# Altium project Fan and Temperature Daughter Board.PrjPcb
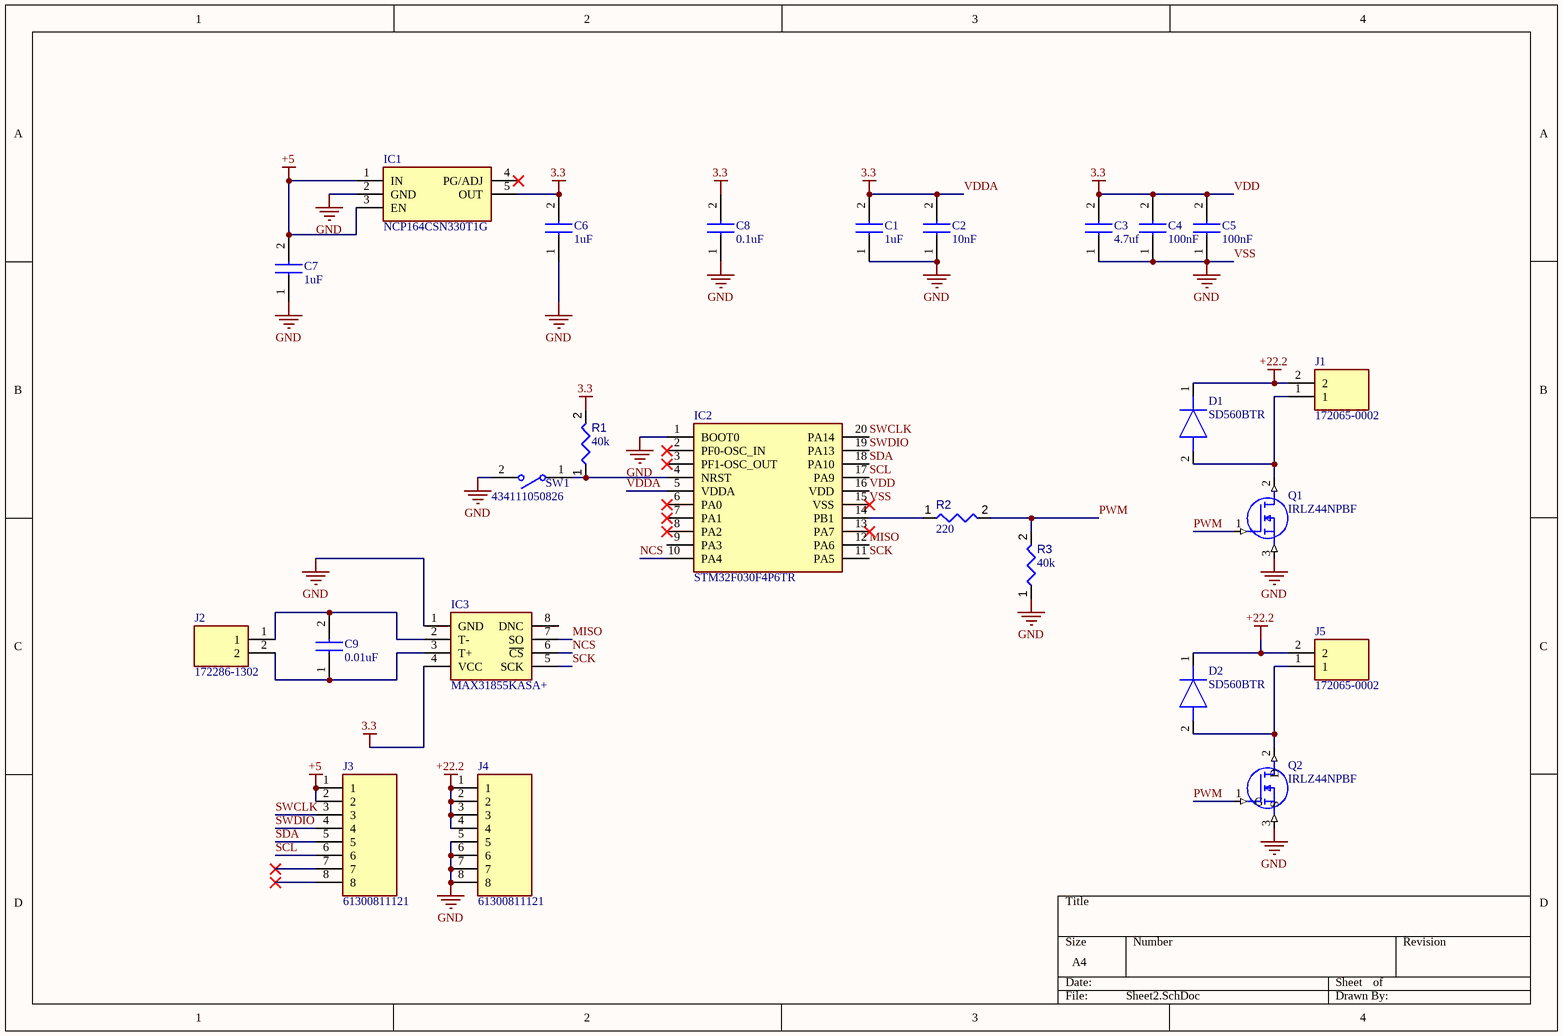
[diagram p0: Sheet2.SchDoc]
1 sheet, 25 parts. Net scope: global (net labels, ports and power ports of the same name join across sheets).
Board file: PCB2.PcbDoc

## Sheet Sheet2.SchDoc
size A4; SheetNumber: 1; SheetTotal: 1

### Parts
C1  1uF  [CAPC2012X94N]
C2  10nF  [CAPC2012X94N]
C3  4.7uf  [CAPC2012X94N]
C4  100nF  [CAPC2012X94N]
C5  100nF  [CAPC2012X94N]
C6  1uF  [CAPC2012X94N]
C7  1uF  [CAPC2012X94N]
C8  0.1uF  [CAPC2012X94N]
C9  0.01uF  [CAPC2012X94N]
D1  SD560BTR  [DIOM5236X260N]
D2  SD560BTR  [DIOM5236X260N]
IC1  NCP164CSN330T1G  [SOT95P275X110-5N]
IC2  STM32F030F4P6TR  [SOP65P640X120-20N]
IC3  MAX31855KASA+  [SOIC127P600X175-8N]
J1  172065-0002  [1720650002]
J2  172286-1302  [172286-YY02]
J3  61300811121  [HDRV8W64P0X254_1X8_2032X254X854P]
J4  61300811121  [HDRV8W64P0X254_1X8_2032X254X854P]
J5  172065-0002  [1720650002]
Q1  IRLZ44NPBF  [TO254P469X1042X1967-3P]
Q2  IRLZ44NPBF  [TO254P469X1042X1967-3P]
R1  value 40k  [RESC0805(2012)_L]  (hidden comment: Resistor 4R7  +/-5 % 0805 125 mW)
R2  value 220  [RESC0805(2012)_L]  (hidden comment: Resistor 4R7  +/-5 % 0805 125 mW)
R3  value 40k  [RESC0805(2012)_L]  (hidden comment: Resistor 4R7  +/-5 % 0805 125 mW)
SW1  434111050826  [434111050826]

### Nets
+5: C7.2 IC1.1(IN) IC1.3(EN) J3.1 J3.2
+22.2: D1.1(K) D2.1(K) J1.2 J4.1 J4.2 J4.3 J4.4 J5.2
VDD: C1.2 C2.2 C3.2 C4.2 C5.2 C6.2 C8.2 IC1.5(OUT) IC2.5(VDDA) IC2.16(VDD) IC3.4(VCC) R1.2  [also labelled 3.3, VDDA]
VSS: C1.1 C2.1 C3.1 C4.1 C5.1 C6.1 C7.1 C8.1 IC1.2(GND) IC2.1(BOOT0) IC2.15(VSS) IC3.1(GND) J4.5 J4.6 J4.7 J4.8 Q1.3(S) Q2.3(S) R3.1 SW1.2  [also labelled GND]
MISO: IC2.12(PA6) IC3.7(SO)
NCS: IC2.10(PA4) IC3.6(~{CS})
PWM: Q1.1(G) Q2.1(G) R2.2 R3.2
SCK: IC2.11(PA5) IC3.5(SCK)
SCL: IC2.17(PA9) J3.6
SDA: IC2.18(PA10) J3.5
SWCLK: IC2.20(PA14) J3.3
SWDIO: IC2.19(PA13) J3.4
NetC9_1: C9.1 IC3.3(T+) J2.2
NetC9_2: C9.2 IC3.2(T-) J2.1
NetD1_2: D1.2(A) J1.1 Q1.2(D)
NetD2_2: D2.2(A) J5.1 Q2.2(D)
NetIC2_4: IC2.4(NRST) R1.1 SW1.1
NetIC2_14: IC2.14(PB1) R2.1

Not connected (* = marked no-connect by the designer): IC1 4(PG/ADJ)*; IC2 2(PF0-OSC_IN)* 3(PF1-OSC_OUT)* 6(PA0)* 7(PA1)* 8(PA2)* 9(PA3) 13(PA7)*; IC3 8(DNC); J3 7* 8*

### Library data of the parts
C1-C9 = 08055C104K4T2A: Capacitor; Manufacturer_Name: Kyocera AVX; Datasheet Link: https://componentsearchengine.com/Datasheets/2/08055C104K4T2A.pdf; Height: 0.94mm; Manufacturer_Part_Number: 08055C104K4T2A; Mouser Part Number: 581-08055C104K4; Mouser Price/Stock: https://www.mouser.co.uk/ProductDetail/KYOCERA-AVX/08055C104K4T2A?qs=xMTsDkQFXIwOG0s%252Bx1urSg%3D%3D; Arrow Part Number: 08055C104K4T2A; Arrow Price/Stock: https://www.arrow.com/en/products/08055c104k4t2a/avx
D1 D2 = SD560BTR: Diode; Manufacturer_Name: SMC Diode Solutions; Datasheet Link: http://www.smc-diodes.com/propdf/SD560B%20N1412%20REV.D.pdf; Height: 2.6mm; Manufacturer_Part_Number: SD560BTR
IC1 = NCP164CSN330T1G: Integrated Circuit; Manufacturer_Name: onsemi; Datasheet Link: https://componentsearchengine.com/Datasheets/2/NCP164CSN330T1G.pdf; Height: 1.1mm; Manufacturer_Part_Number: NCP164CSN330T1G; Mouser Part Number: 863-NCP164CSN330T1G; Mouser Price/Stock: https://www.mouser.co.uk/ProductDetail/onsemi/NCP164CSN330T1G?qs=xZ%2FP%252Ba9zWqbi%2FAyy5UtoRw%3D%3D; Arrow Part Number: NCP164CSN330T1G; Arrow Price/Stock: https://www.arrow.com/en/products/ncp164csn330t1g/on-semiconductor?utm_currency=USD&region=nac
IC2 = STM32F030F4P6TR: Integrated Circuit; Manufacturer_Name: STMicroelectronics; Datasheet Link: https://www.st.com/resource/en/datasheet/stm32f030rc.pdf; Height: 1.2mm; Manufacturer_Part_Number: STM32F030F4P6TR; Mouser Part Number: 511-STM32F030F4P6TR; Mouser Price/Stock: https://www.mouser.co.uk/ProductDetail/STMicroelectronics/STM32F030F4P6TR?qs=MavH1QghrkE4yfyLOfvVsw%3D%3D; Arrow Part Number: STM32F030F4P6TR; Arrow Price/Stock: https://www.arrow.com/en/products/stm32f030f4p6tr/stmicroelectronics?utm_currency=USD&region=nac
IC3 = MAX31855KASA+: Integrated Circuit; Manufacturer_Name: Analog Devices; Datasheet Link: https://datasheets.maximintegrated.com/en/ds/MAX31855.pdf; Height: 1.75mm; Manufacturer_Part_Number: MAX31855KASA+; Mouser Part Number: 700-MAX31855KASA+; Mouser Price/Stock: https://www.mouser.co.uk/ProductDetail/Analog-Devices-Maxim-Integrated/MAX31855KASA%2b?qs=ffX8NcjNb2QF5YDuL5Qj5g%3D%3D; Arrow Part Number: MAX31855KASA+; Arrow Price/Stock: https://www.arrow.com/en/products/max31855kasa/analog-devices?utm_currency=USD&region=nac
J1 J5 = 172065-0002: Connector; Manufacturer_Name: Molex; Datasheet Link: https://www.molex.com/pdm_docs/sd/1720650002_sd.pdf; Height: 14.8mm; Manufacturer_Part_Number: 172065-0002; Mouser Part Number: 538-172065-0002; Mouser Price/Stock: https://www.mouser.co.uk/ProductDetail/Molex/172065-0002?qs=MxnWX8BLHKc63YRsWKsBxw%3D%3D
J2 = 172286-1302: Connector; Manufacturer_Name: Molex; Datasheet Link: https://www.molex.com/pdm_docs/sd/1722861102_sd.pdf; Height: 14mm; Manufacturer_Part_Number: 172286-1302; Mouser Part Number: 538-172286-1302; Mouser Price/Stock: https://www.mouser.co.uk/ProductDetail/Molex/172286-1302?qs=M4iqfhoVaNrqWbEQuvhqgw%3D%3D
J3 J4 = 61300811121: Connector; Manufacturer_Name: Wurth Elektronik; Datasheet Link: http://katalog.we-online.de/em/datasheet/6130xx11121.pdf; Height: 8.54mm; Manufacturer_Part_Number: 61300811121; Mouser Part Number: 710-61300811121; Mouser Price/Stock: https://www.mouser.co.uk/ProductDetail/Wurth-Elektronik/61300811121?qs=PhR8RmCirEZRdx%252BVlEmRRA%3D%3D
Q1 Q2 = IRLZ44NPBF: MOSFET (N-Channel); Manufacturer_Name: Infineon; Datasheet Link: http://www.irf.com/product-info/datasheets/data/irlz44n.pdf; Height: 4.69mm; Manufacturer_Part_Number: IRLZ44NPBF; Mouser Part Number: 942-IRLZ44NPBF; Mouser Price/Stock: https://www.mouser.co.uk/ProductDetail/Infineon-Technologies/IRLZ44NPBF?qs=9%252BKlkBgLFf15OZZk%252BD0ibg%3D%3D; Arrow Part Number: IRLZ44NPBF; Arrow Price/Stock: https://www.arrow.com/en/products/irlz44npbf/infineon-technologies-ag?utm_currency=USD&region=europe
R1-R3 = CMP-009-00174-3: Chip Resistor, 4,7 Ohms, +/-5 %, 125 mW, -55 to 155 degC, 0805; Tolerance: 5%; Power: 125mW; Max Operating Temperature: 155°C; Case/Package: 0805; Min Operating Temperature: -55°C; Pins: 2
SW1 = CMP-011-00014-1: Keypad Switch, 1 Switches, SPST, Momentary-tactile, 0.05A, 12VDC, 3.24N, Solder Terminal, Surface Mount-straight; Min Operating Temperature: -40°C; Mounting Technology: Surface Mount; RoHS Compliant: Yes; Max Operating Temperature: 85°C